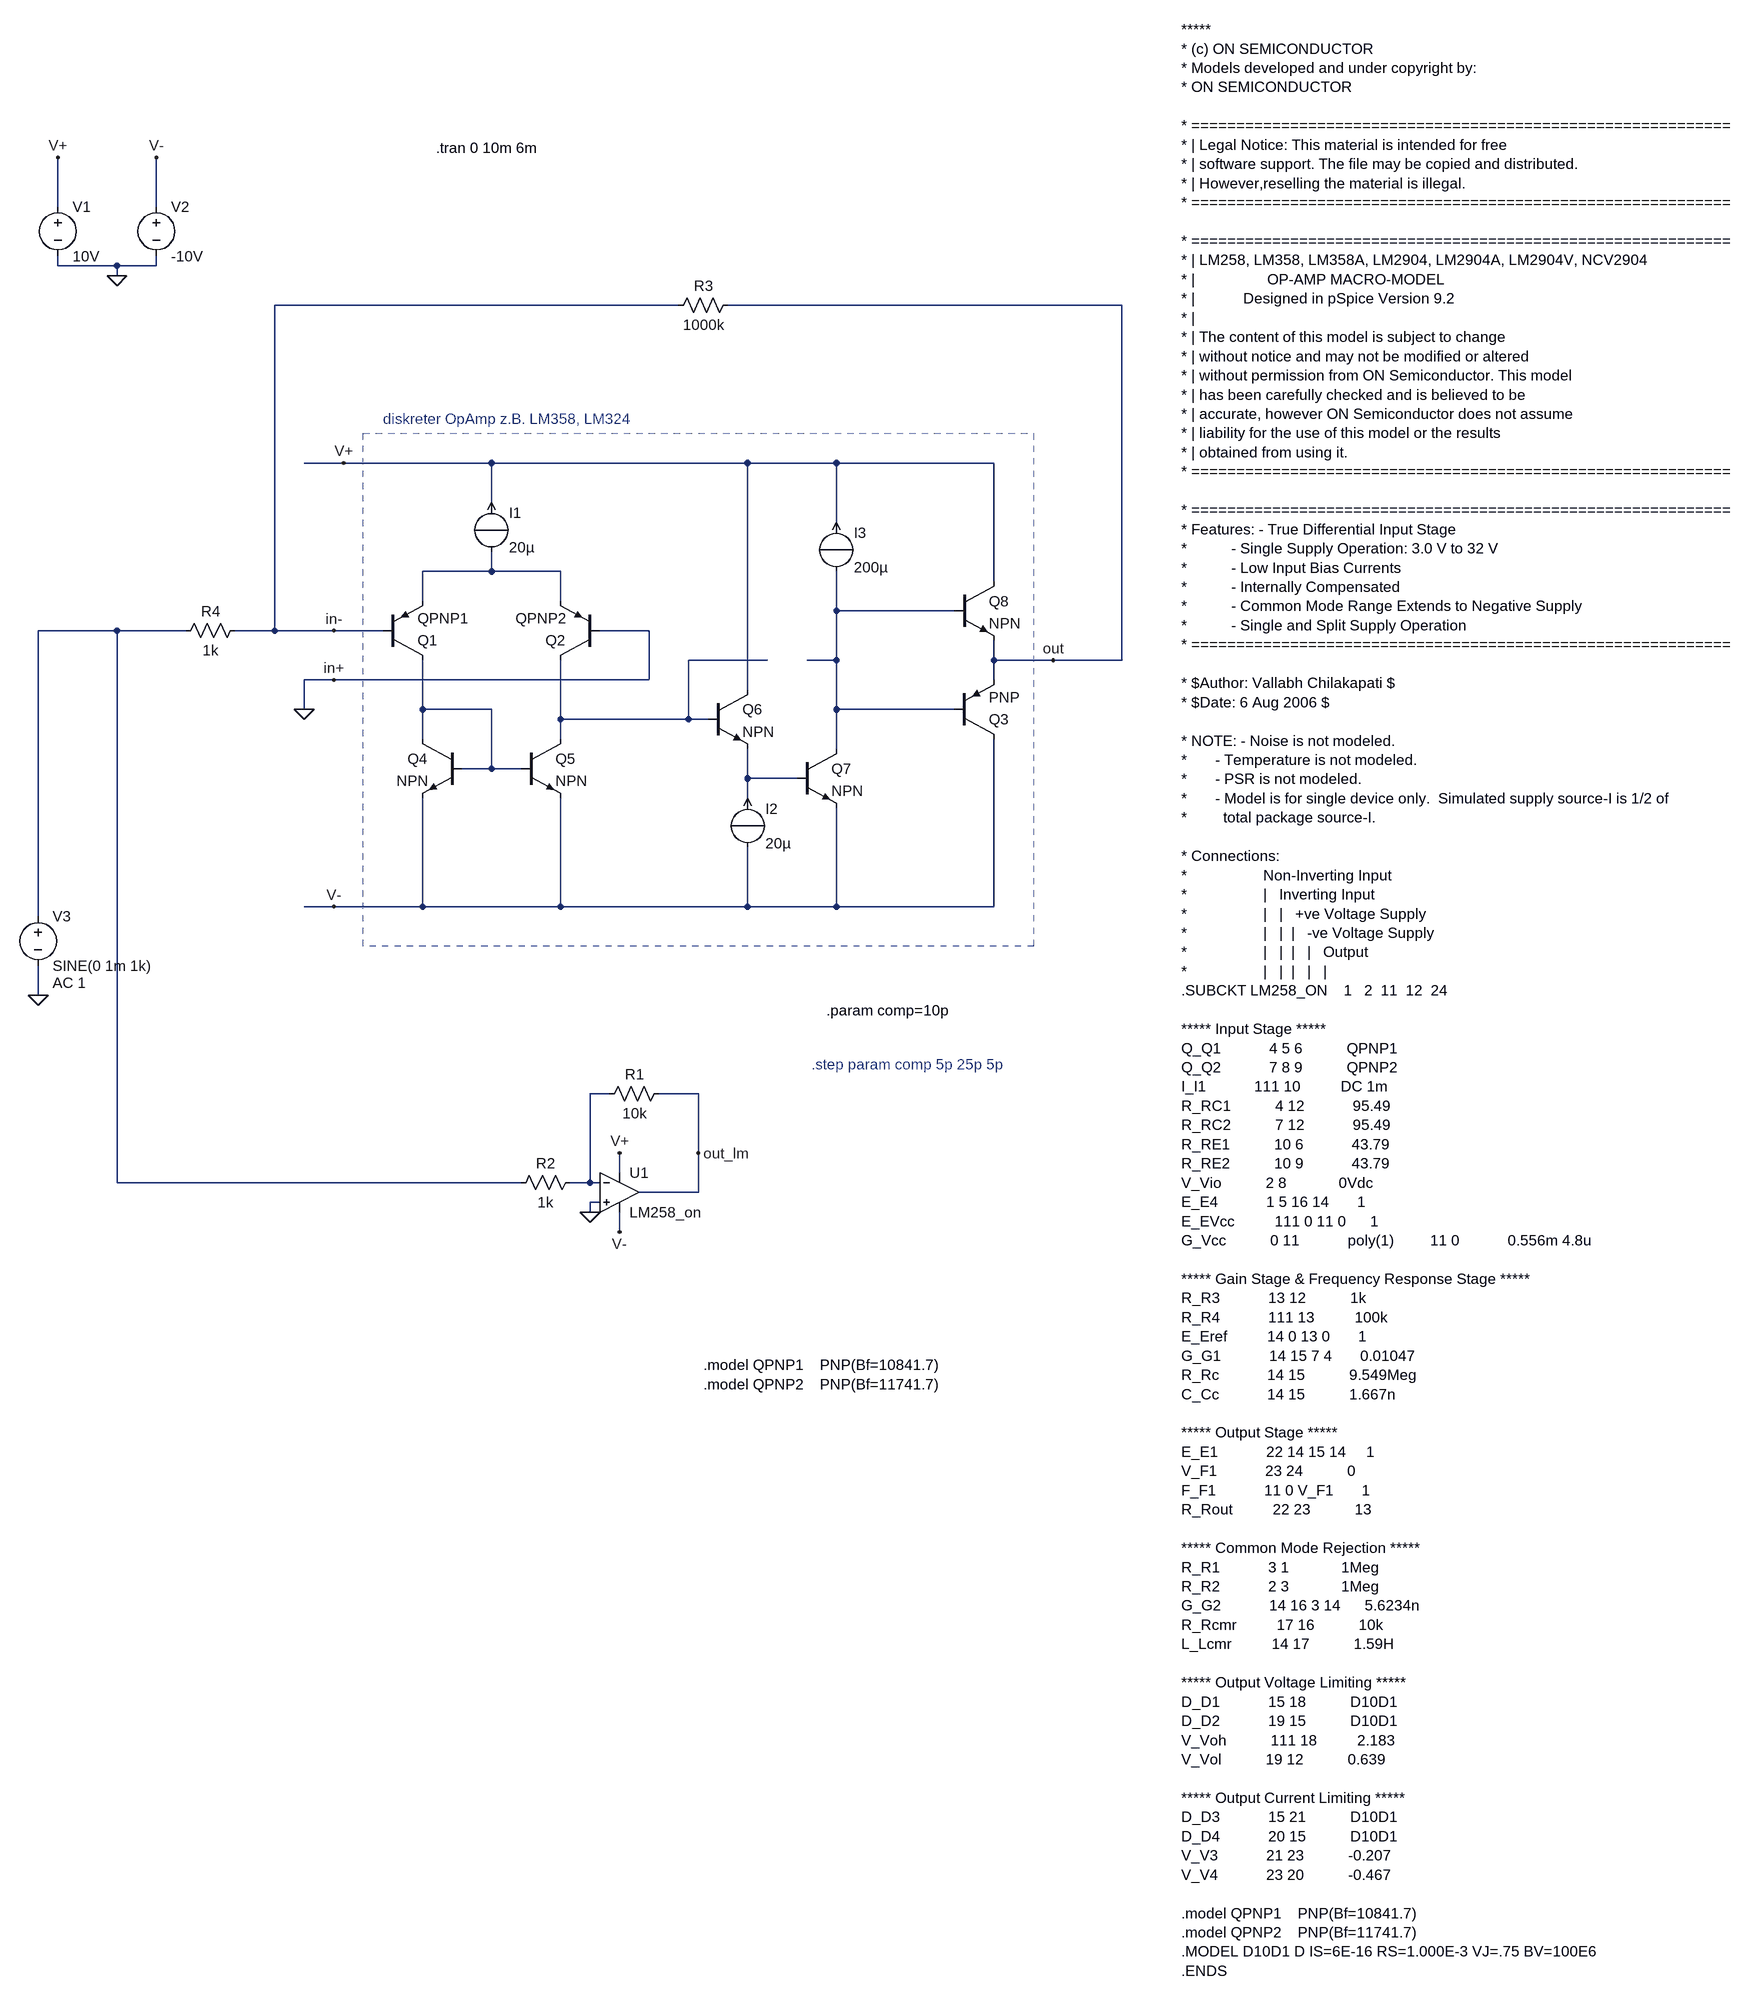
[diagram p0: schematic LM358_diskret_source-I.asc]
LM358_diskret_source-I.asc, the LTspice schematic file:
Version 4
SHEET 1 3176 2012
WIRE -544 -544 -544 -624
WIRE -384 -544 -384 -624
WIRE -544 -448 -544 -464
WIRE -448 -448 -544 -448
WIRE -384 -448 -384 -464
WIRE -384 -448 -448 -448
WIRE -448 -432 -448 -448
WIRE 464 -384 -192 -384
WIRE 1184 -384 544 -384
WIRE -80 -128 -144 -128
WIRE 160 -128 -80 -128
WIRE 576 -128 160 -128
WIRE 720 -128 576 -128
WIRE 976 -128 720 -128
WIRE 160 -64 160 -128
WIRE 720 -32 720 -128
WIRE 160 48 160 16
WIRE 160 48 48 48
WIRE 272 48 160 48
WIRE 976 64 976 -128
WIRE 48 96 48 48
WIRE 272 96 272 48
WIRE 720 112 720 48
WIRE 912 112 720 112
WIRE -448 144 -576 144
WIRE -336 144 -448 144
WIRE -192 144 -192 -384
WIRE -192 144 -256 144
WIRE -96 144 -192 144
WIRE -16 144 -96 144
WIRE 416 144 336 144
WIRE 608 192 480 192
WIRE 720 192 720 112
WIRE 720 192 672 192
WIRE 976 192 976 160
WIRE 1072 192 976 192
WIRE 1184 192 1184 -384
WIRE 1184 192 1072 192
WIRE -96 224 -144 224
WIRE 416 224 416 144
WIRE 416 224 -96 224
WIRE 976 224 976 192
WIRE 576 240 576 -128
WIRE -144 272 -144 224
WIRE 48 272 48 192
WIRE 160 272 48 272
WIRE 720 272 720 192
WIRE 912 272 720 272
WIRE 272 288 272 192
WIRE 480 288 480 192
WIRE 480 288 272 288
WIRE 512 288 480 288
WIRE 48 320 48 272
WIRE 272 320 272 288
WIRE 720 336 720 272
WIRE 160 368 160 272
WIRE 160 368 112 368
WIRE 208 368 160 368
WIRE 576 384 576 336
WIRE 656 384 576 384
WIRE 576 416 576 384
WIRE -96 592 -144 592
WIRE 48 592 48 416
WIRE 48 592 -96 592
WIRE 272 592 272 416
WIRE 272 592 48 592
WIRE 576 592 576 496
WIRE 576 592 272 592
WIRE 720 592 720 432
WIRE 720 592 576 592
WIRE 976 592 976 320
WIRE 976 592 720 592
WIRE -576 608 -576 144
WIRE -576 736 -576 688
WIRE 352 896 320 896
WIRE 496 896 432 896
WIRE 496 992 496 896
WIRE 368 1024 368 992
WIRE -448 1040 -448 144
WIRE 208 1040 -448 1040
WIRE 320 1040 320 896
WIRE 320 1040 288 1040
WIRE 336 1040 320 1040
WIRE 496 1056 496 992
WIRE 496 1056 400 1056
WIRE 336 1072 320 1072
WIRE 320 1088 320 1072
WIRE 368 1120 368 1088
FLAG -96 144 in-
FLAG -80 -128 V+
FLAG -96 592 V-
FLAG 1072 192 out
FLAG -96 224 in+
FLAG 368 992 V+
FLAG 368 1120 V-
FLAG -448 -432 0
FLAG -544 -624 V+
FLAG -384 -624 V-
FLAG -576 736 0
FLAG 320 1088 0
FLAG -144 272 0
FLAG 496 992 out_lm
SYMBOL pnp -16 192 M180
SYMATTR InstName Q1
SYMATTR Value QPNP1
SYMBOL pnp 336 192 R180
SYMATTR InstName Q2
SYMATTR Value QPNP2
SYMBOL pnp 912 320 M180
SYMATTR InstName Q3
SYMBOL npn 112 320 M0
SYMATTR InstName Q4
SYMBOL npn 208 320 R0
SYMATTR InstName Q5
SYMBOL npn 512 240 R0
SYMATTR InstName Q6
SYMBOL npn 656 336 R0
SYMATTR InstName Q7
SYMBOL npn 912 64 R0
SYMATTR InstName Q8
SYMBOL source-I 160 -64 R0
WINDOW 123 0 0 Left 2
WINDOW 39 0 0 Left 2
SYMATTR InstName I1
SYMATTR Value 20µ
SYMBOL source-I 576 416 R0
WINDOW 123 0 0 Left 2
WINDOW 39 0 0 Left 2
SYMATTR InstName I2
SYMATTR Value 20µ
SYMBOL source-I 720 -32 R0
WINDOW 123 0 0 Left 2
WINDOW 39 0 0 Left 2
SYMATTR InstName I3
SYMATTR Value 200µ
SYMBOL Opamps\\opamp2 368 992 R0
SYMATTR InstName U1
SYMATTR Value LM258_on
SYMBOL voltage -544 -560 R0
WINDOW 123 0 0 Left 2
WINDOW 39 0 0 Left 2
SYMATTR InstName V1
SYMATTR Value 10V
SYMBOL voltage -384 -560 R0
WINDOW 123 0 0 Left 2
WINDOW 39 0 0 Left 2
SYMATTR InstName V2
SYMATTR Value -10V
SYMBOL res 448 880 R90
WINDOW 0 0 56 VBottom 2
WINDOW 3 32 56 VTop 2
SYMATTR InstName R1
SYMATTR Value 10k
SYMBOL res 304 1024 R90
WINDOW 0 0 56 VBottom 2
WINDOW 3 32 56 VTop 2
SYMATTR InstName R2
SYMATTR Value 1k
SYMBOL res 560 -400 R90
WINDOW 0 0 56 VBottom 2
WINDOW 3 32 56 VTop 2
SYMATTR InstName R3
SYMATTR Value 1000k
SYMBOL res -240 128 R90
WINDOW 0 0 56 VBottom 2
WINDOW 3 32 56 VTop 2
SYMATTR InstName R4
SYMATTR Value 1k
SYMBOL voltage -576 592 R0
WINDOW 123 24 124 Left 2
WINDOW 39 0 0 Left 2
SYMATTR InstName V3
SYMATTR Value SINE(0 1m 1k)
SYMATTR Value2 AC 1
TEXT -16 -200 Left 2 ;diskreter OpAmp z.B. LM358, LM324
TEXT 1280 -832 Left 2 !*****\n* (c) ON SEMICONDUCTOR\n* Models developed and under copyright by:\n* ON SEMICONDUCTOR \n \n* ============================================================\n* | Legal Notice: This material is intended for free  \n* | software support. The file may be copied and distributed. \n* | However,reselling the material is illegal.\n* ============================================================\n \n* ============================================================      \n* | LM258, LM358, LM358A, LM2904, LM2904A, LM2904V, NCV2904\n* |                  OP-AMP MACRO-MODEL\n* |            Designed in pSpice Version 9.2\n* |\n* | The content of this model is subject to change\n* | without notice and may not be modified or altered\n* | without permission from ON Semiconductor. This model\n* | has been carefully checked and is believed to be\n* | accurate, however ON Semiconductor does not assume \n* | liability for the use of this model or the results \n* | obtained from using it.\n* ============================================================\n \n* ============================================================\n* Features: - True Differential Input Stage\n*           - Single Supply Operation: 3.0 V to 32 V\n*           - Low Input Bias Currents\n*           - Internally Compensated\n*           - Common Mode Range Extends to Negative Supply\n*           - Single and Split Supply Operation\n* ============================================================\n \n* $Author: Vallabh Chilakapati $\n* $Date: 6 Aug 2006 $\n \n* NOTE: - Noise is not modeled.\n*       - Temperature is not modeled.\n*       - PSR is not modeled.\n*       - Model is for single device only.  Simulated supply source-I is 1/2 of\n*         total package source-I.\n \n* Connections:\n*                   Non-Inverting Input\n*                   |   Inverting Input\n*                   |   |   +ve Voltage Supply\n*                   |   |  |   -ve Voltage Supply\n*                   |   |  |   |   Output\n*                   |   |  |   |   |\n.SUBCKT LM258_ON    1   2  11  12  24\n \n***** Input Stage *****\nQ_Q1            4 5 6           QPNP1    \nQ_Q2            7 8 9           QPNP2\nI_I1            111 10          DC 1m\nR_RC1           4 12            95.49 \nR_RC2           7 12            95.49\nR_RE1           10 6            43.79 \nR_RE2           10 9            43.79\nV_Vio           2 8             0Vdc\nE_E4            1 5 16 14       1\nE_EVcc          111 0 11 0      1\nG_Vcc           0 11            poly(1)         11 0            0.556m 4.8u\n \n***** Gain Stage & Frequency Response Stage *****\nR_R3            13 12           1k  \nR_R4            111 13          100k  \nE_Eref          14 0 13 0       1\nG_G1            14 15 7 4       0.01047\nR_Rc            14 15           9.549Meg \nC_Cc            14 15           1.667n \n \n***** Output Stage *****\nE_E1            22 14 15 14     1\nV_F1            23 24           0\nF_F1            11 0 V_F1       1\nR_Rout          22 23           13\n \n***** Common Mode Rejection *****\nR_R1            3 1             1Meg\nR_R2            2 3             1Meg\nG_G2            14 16 3 14      5.6234n\nR_Rcmr          17 16           10k\nL_Lcmr          14 17           1.59H \n \n***** Output Voltage Limiting *****\nD_D1            15 18           D10D1\nD_D2            19 15           D10D1 \nV_Voh           111 18          2.183\nV_Vol           19 12           0.639\n \n***** Output Current Limiting *****\nD_D3            15 21           D10D1 \nD_D4            20 15           D10D1 \nV_V3            21 23           -0.207\nV_V4            23 20           -0.467\n \n.model QPNP1    PNP(Bf=10841.7)\n.model QPNP2    PNP(Bf=11741.7)\n.MODEL D10D1 D IS=6E-16 RS=1.000E-3 VJ=.75 BV=100E6\n.ENDS
TEXT 70 -640 Left 2 !.tran 0 10m 6m
TEXT 704 760 Left 2 !.param comp=10p
TEXT 680 848 Left 2 ;.step param comp 5p 25p 5p
TEXT 504 1336 Left 2 !.model QPNP1    PNP(Bf=10841.7)\n.model QPNP2    PNP(Bf=11741.7)
RECTANGLE Normal 1040 656 -48 -176 2

The netlist it stands for:
* LM358_diskret_source-I.asc
Q1 N005 in- N001 0 QPNP1
Q2 N004 0 N001 0 QPNP2
Q3 V- N002 out 0 PNP
Q4 N005 N005 V- 0 NPN
Q5 N004 N005 V- 0 NPN
Q6 V+ N004 N006 0 NPN
Q7 N002 N006 V- 0 NPN
Q8 V+ N002 out 0 NPN
I1 N001 V+ 20µ
I2 V- N006 20µ
I3 N002 V+ 200µ
XU1 0 N007 V+ V- out_lm LM258_on  ; pins In+ In- V+ V- OUT
V1 V+ 0 10V
V2 V- 0 -10V
R1 out_lm N007 10k
R2 N007 N003 1k
R3 out in- 1000k
R4 in- N003 1k
V3 N003 0 SINE(0 1m 1k) AC 1
.model NPN NPN
.model PNP PNP
.lib standard.bjt
* diskreter OpAmp z.B. LM358, LM324
*****
* (c) ON SEMICONDUCTOR
* Models developed and under copyright by:
* ON SEMICONDUCTOR
* ============================================================
* | Legal Notice: This material is intended for free
* | software support. The file may be copied and distributed.
* | However,reselling the material is illegal.
* ============================================================
* ============================================================
* | LM258, LM358, LM358A, LM2904, LM2904A, LM2904V, NCV2904
* |                  OP-AMP MACRO-MODEL
* |            Designed in pSpice Version 9.2
* |
* | The content of this model is subject to change
* | without notice and may not be modified or altered
* | without permission from ON Semiconductor. This model
* | has been carefully checked and is believed to be
* | accurate, however ON Semiconductor does not assume
* | liability for the use of this model or the results
* | obtained from using it.
* ============================================================
* ============================================================
* Features: - True Differential Input Stage
*           - Single Supply Operation: 3.0 V to 32 V
*           - Low Input Bias Currents
*           - Internally Compensated
*           - Common Mode Range Extends to Negative Supply
*           - Single and Split Supply Operation
* ============================================================
* $Author: Vallabh Chilakapati $
* $Date: 6 Aug 2006 $
* NOTE: - Noise is not modeled.
*       - Temperature is not modeled.
*       - PSR is not modeled.
*       - Model is for single device only.  Simulated supply source-I is 1/2 of
*         total package source-I.
* Connections:
*                   Non-Inverting Input
*                   |   Inverting Input
*                   |   |   +ve Voltage Supply
*                   |   |  |   -ve Voltage Supply
*                   |   |  |   |   Output
*                   |   |  |   |   |
.SUBCKT LM258_ON    1   2  11  12  24
***** Input Stage *****
Q_Q1            4 5 6           QPNP1
Q_Q2            7 8 9           QPNP2
I_I1            111 10          DC 1m
R_RC1           4 12            95.49
R_RC2           7 12            95.49
R_RE1           10 6            43.79
R_RE2           10 9            43.79
V_Vio           2 8             0Vdc
E_E4            1 5 16 14       1
E_EVcc          111 0 11 0      1
G_Vcc           0 11            poly(1)         11 0            0.556m 4.8u
***** Gain Stage & Frequency Response Stage *****
R_R3            13 12           1k
R_R4            111 13          100k
E_Eref          14 0 13 0       1
G_G1            14 15 7 4       0.01047
R_Rc            14 15           9.549Meg
C_Cc            14 15           1.667n
***** Output Stage *****
E_E1            22 14 15 14     1
V_F1            23 24           0
F_F1            11 0 V_F1       1
R_Rout          22 23           13
***** Common Mode Rejection *****
R_R1            3 1             1Meg
R_R2            2 3             1Meg
G_G2            14 16 3 14      5.6234n
R_Rcmr          17 16           10k
L_Lcmr          14 17           1.59H
***** Output Voltage Limiting *****
D_D1            15 18           D10D1
D_D2            19 15           D10D1
V_Voh           111 18          2.183
V_Vol           19 12           0.639
***** Output Current Limiting *****
D_D3            15 21           D10D1
D_D4            20 15           D10D1
V_V3            21 23           -0.207
V_V4            23 20           -0.467
.model QPNP1    PNP(Bf=10841.7)
.model QPNP2    PNP(Bf=11741.7)
.MODEL D10D1 D IS=6E-16 RS=1.000E-3 VJ=.75 BV=100E6
.ENDS
.tran 0 10m 6m
.param comp=10p
* .step param comp 5p 25p 5p
.model QPNP1    PNP(Bf=10841.7)
.model QPNP2    PNP(Bf=11741.7)
.backanno
.end